# Altium schematic sheet Port.SchDoc
size A4; SheetNumber: 4; SheetTotal: 5
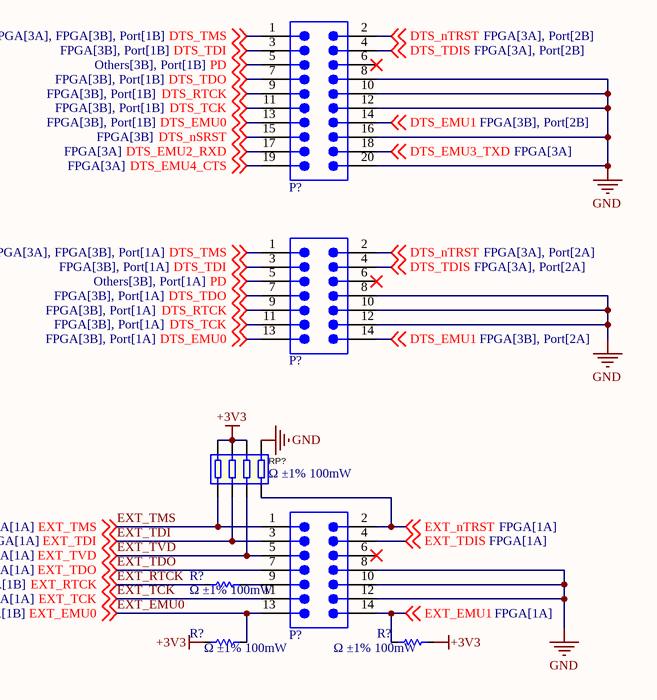
[diagram p0: Port.SchDoc]

## Parts
(Parts that share a designator on the sheet are numbered #1, #2 ... from top to bottom, then left to right.)
P?#1  61202021721  [61202021721]  (value not drawn)
P?#2  61201421621  [61201421621]  (value not drawn)
P?#3  61201421621  [61201421621]  (value not drawn)
R?#1  Ω ±1% 100mW  [R0603]
R?#2  Ω ±1% 100mW  [R0603]
R?#3  Ω ±1% 100mW  [R0603]
RP?  Ω ±1% 100mW  [RES-ARRAY-SMD_0402-8P-L2.0-W1.0-BL]

## Nets
+3V3: R?#2.1 R?#3.2 RP?.6 RP?.7 RP?.8
GND: P?#1.8 P?#1.10 P?#1.12 P?#1.16 P?#1.20 P?#2.8 P?#2.10 P?#2.12 P?#3.8 P?#3.10 P?#3.12 RP?.5
DTS_EMU0: P?#1.13 P?#2.13 ; off-sheet DTS_EMU0
DTS_EMU1: P?#1.14 P?#2.14 ; off-sheet DTS_EMU1
DTS_EMU2_RXD: P?#1.17 ; off-sheet DTS_EMU2_RXD
DTS_EMU3_TXD: P?#1.18 ; off-sheet DTS_EMU3_TXD
DTS_EMU4_CTS: P?#1.19 ; off-sheet DTS_EMU4_CTS
DTS_nSRST: P?#1.15 ; off-sheet DTS_nSRST
DTS_nTRST: P?#1.2 P?#2.2 ; off-sheet DTS_nTRST
DTS_RTCK: P?#1.9 P?#2.9 ; off-sheet DTS_RTCK
DTS_TCK: P?#1.11 P?#2.11 ; off-sheet DTS_TCK
DTS_TDI: P?#1.3 P?#2.3 ; off-sheet DTS_TDI
DTS_TDIS: P?#1.4 P?#2.4 ; off-sheet DTS_TDIS
DTS_TDO: P?#1.7 P?#2.7 ; off-sheet DTS_TDO
DTS_TMS: P?#1.1 P?#2.1 ; off-sheet DTS_TMS
EXT_EMU0: P?#3.13 R?#2.2 ; off-sheet EXT_EMU0
EXT_EMU1: P?#3.14 R?#3.1 ; off-sheet EXT_EMU1
EXT_nTRST: P?#3.2 RP?.4 ; off-sheet EXT_nTRST
EXT_RTCK: R?#1.1 ; off-sheet EXT_RTCK
EXT_TCK: P?#3.11 ; off-sheet EXT_TCK
EXT_TDI: P?#3.3 RP?.2 ; off-sheet EXT_TDI
EXT_TDIS: P?#3.4 ; off-sheet EXT_TDIS
EXT_TDO: P?#3.7 ; off-sheet EXT_TDO
EXT_TMS: P?#3.1 RP?.1 ; off-sheet EXT_TMS
EXT_TVD: P?#3.5 RP?.3 ; off-sheet EXT_TVD
PD: P?#1.5 P?#2.5 ; off-sheet PD
NetP?#3_9: P?#3.9 R?#1.2

Not connected (* = marked no-connect by the designer): P?#1 6*; P?#2 6*; P?#3 6*

## Library data of the parts
P?#1 = 61202021721: WR-BHD Male Box Header, THT Right Angle, pitch 2.54mm, 2 Row, 20 pin; Manufacturer: Wurth Elektronik; Contact Resistance: 20mOhm; Insulation Resistance: 1000MOhm; Rated Current: 3A; Working Voltage: 250V; Withstanding Voltage: 500V; Manufacturer Part Number: 61202021721; Category: Wire-to-Board Connectors; Match Code: WR-BHD; ComponentLink1Description: Website Link; ComponentLink1URL: https://www.we-online.com/redexpert/article/61202021721?ad; ComponentLink2Description: Datasheet Link; ComponentLink2URL: https://www.we-online.com/redexpert/spec/61202021721?ad; Mount: Through Hole; Operating Temperature Max: 105°C; Operating Temperature Min: -40°C; Packaging: Tray; Length: 33.06mm; Width: 13.23mm; Height: 9.1mm; Gender: Male; Number of Pins: 20; Number of Rows: 2; Orientation: Right Angle; Pitch: 2.54mm
P?#2 P?#3 = 61201421621: WR-BHD Male Box Header, THT Straight, pitch 2.54mm, 2 Row, 14 pin; Manufacturer: Wurth Elektronik; Contact Resistance: 20mOhm; Insulation Resistance: 1000MOhm; Rated Current: 3A; Working Voltage: 250V; Withstanding Voltage: 500V; Manufacturer Part Number: 61201421621; Category: Wire-to-Board Connectors; Match Code: WR-BHD; ComponentLink1Description: Website Link; ComponentLink1URL: https://www.we-online.com/redexpert/article/61201421621?ad; ComponentLink2Description: Datasheet Link; ComponentLink2URL: https://www.we-online.com/redexpert/spec/61201421621?ad; Mount: Through Hole; Operating Temperature Max: 105°C; Operating Temperature Min: -40°C; Packaging: Tray; Length: 25.44mm; Width: 9.1mm; Height: 9.1mm; Gender: Male; Number of Pins: 14; Number of Rows: 2; Orientation: Straight; Pitch: 2.54mm
R?#1-R?#3 = Res: Resistor; Published: 8-Jun-2000; LatestRevisionDate: 17-Jul-2002; LatestRevisionNote: Re-released for DXP Platform.; PackageReference: AXIAL-0.3; Publisher: Altium Limited; PackageDescription: Axial Device, Thru-Hole; 2 Leads; 0.3 in Pin Spacing
RP? = RP: Manufacturer: YAGEO(国巨); Name: 30Ω; Symbol: YC124-JR-0730RL; Add into BOM: yes; Value: 30Ω; Tolerance: ±5%; Power(Watts): 62.5mW; Number of Resistors: 4; Temperature Coefficient: ±200ppm/℃; Device: YC124-JR-0730RL; LCSC Part Name: 30Ω ±5% 0402x4; Supplier Part: C136847; Manufacturer Part: YC124-JR-0730RL; Supplier Footprint: 0402x4; JLCPCB Part Class: Extended Part; Datasheet: https://atta.szlcsc.com/upload/public/pdf/source/20171116/C136847_15108221195481123713.pdf; Supplier: LCSC; Convert to PCB: yes; Number of Pins: 8